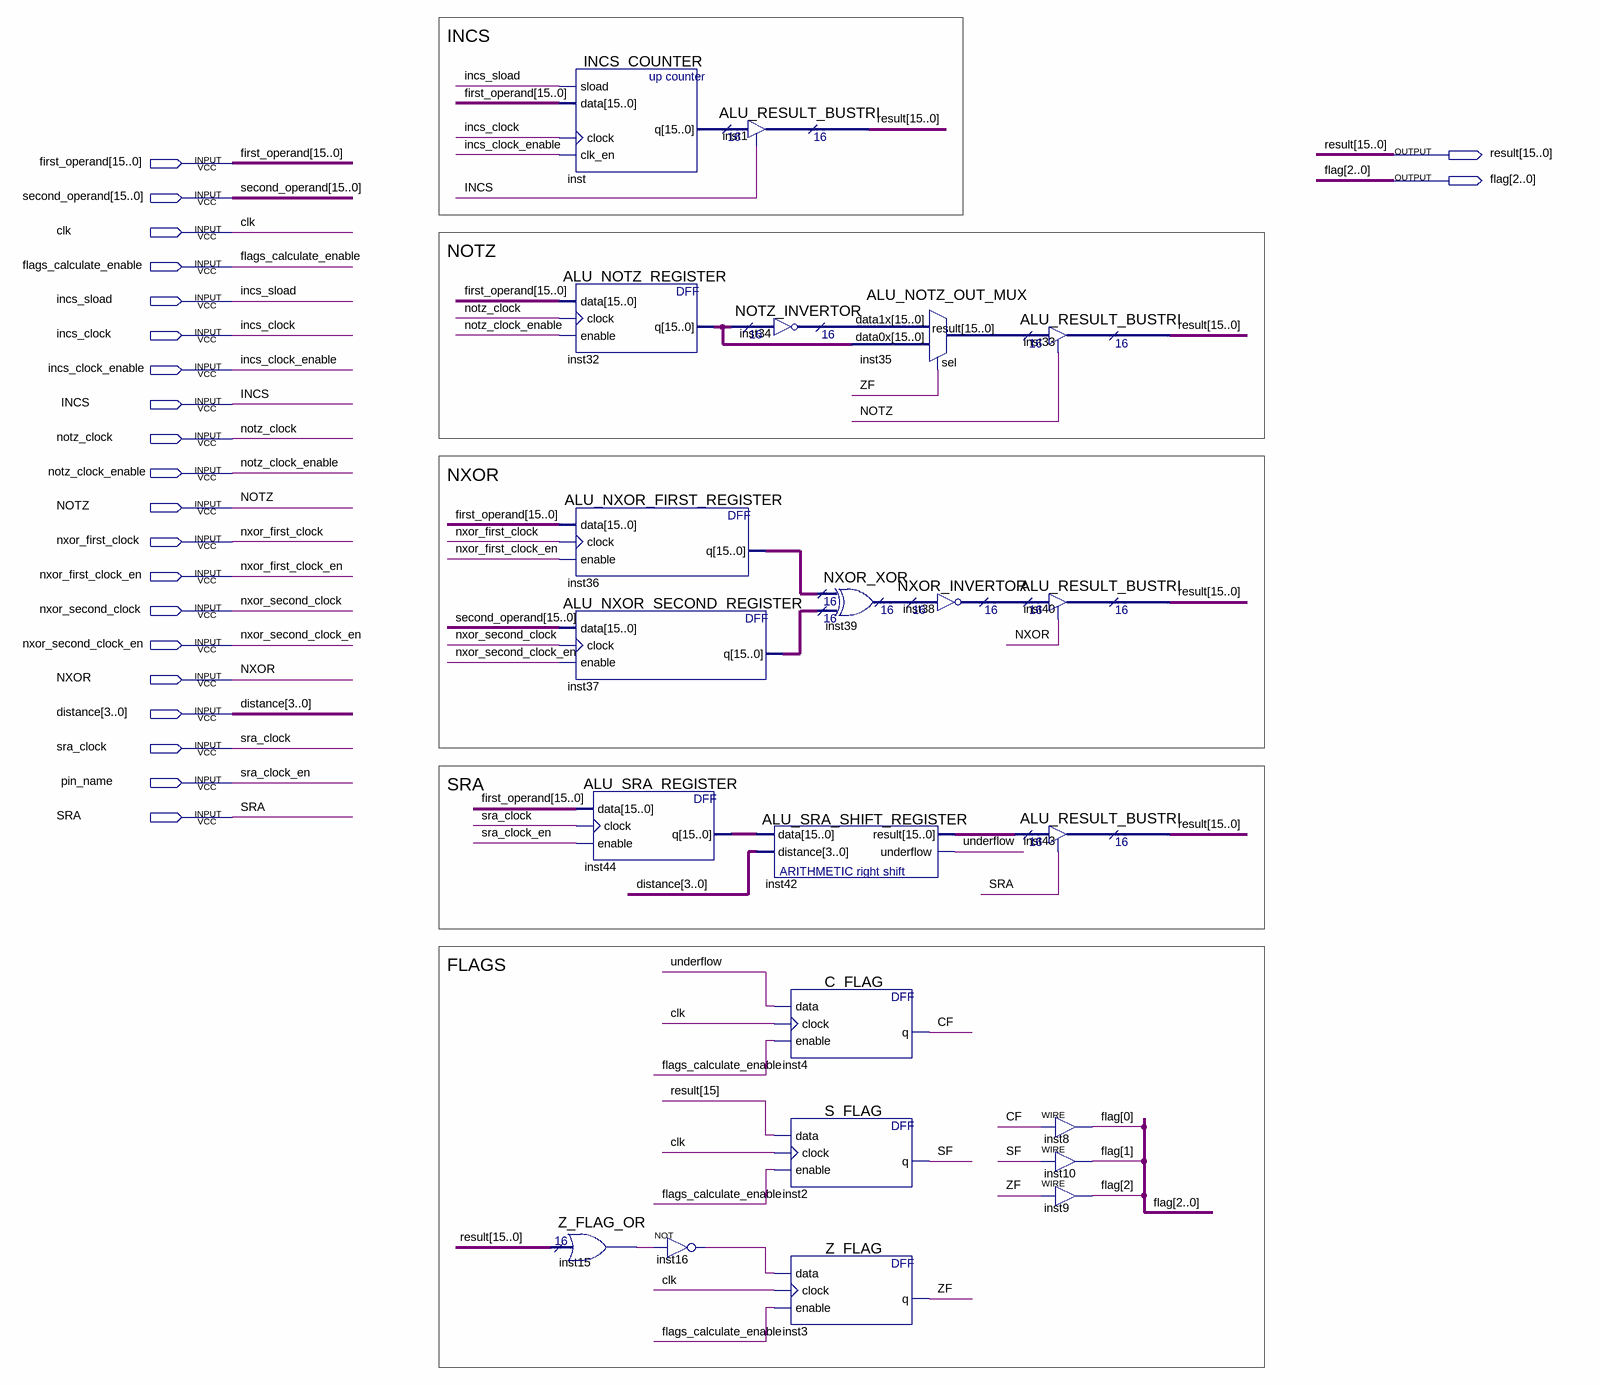
[diagram p0: schematic sheet]
// Quartus schematic ALU.bdf as structural Verilog: 22 symbols, 22 pins
module ALU (
  input  [15:0] first_operand,
  input  [15:0] second_operand,
  input  clk,
  input  flags_calculate_enable,
  input  incs_sload,
  input  incs_clock,
  input  incs_clock_enable,
  input  INCS,
  input  notz_clock,
  input  notz_clock_enable,
  input  NOTZ,
  input  nxor_first_clock,
  input  nxor_first_clock_en,
  input  nxor_second_clock,
  input  nxor_second_clock_en,
  input  NXOR,
  input  [3:0] distance,
  input  sra_clock,
  input  pin_name,
  input  SRA,
  output [15:0] result,
  output [2:0] flag
);

  wire CF, inst15_result, inst16_out, SF, underflow, ZF;
  wire [15:0] inst32_q, inst34_result, inst35_result, inst36_q, inst37_q, inst38_result, inst39_result,
       inst42_result, inst44_q, inst_q;

  Z_FLAG_OR inst15 (.data(result), .result(inst15_result));
  INCS_COUNTER inst (
    .sload(incs_sload), .data(first_operand), .clock(incs_clock), .clk_en(incs_clock_enable), .q(inst_q));
  ALU_NOTZ_REGISTER inst32 (.data(first_operand), .clock(notz_clock), .enable(notz_clock_enable), .q(inst32_q));
  ALU_NXOR_FIRST_REGISTER inst36 (
    .data(first_operand), .clock(nxor_first_clock), .enable(nxor_first_clock_en), .q(inst36_q));
  ALU_NXOR_SECOND_REGISTER inst37 (
    .data(second_operand), .clock(nxor_second_clock), .enable(nxor_second_clock_en), .q(inst37_q));
  ALU_SRA_REGISTER inst44 (.data(first_operand), .clock(sra_clock), .enable(pin_name), .q(inst44_q));
  not inst16 (inst16_out, inst15_result);
  ALU_RESULT_BUSTRI inst1 (.enabledt(INCS), .data(inst_q), .tridata(result));
  NOTZ_INVERTOR inst34 (.data(inst32_q), .result(inst34_result));
  ALU_SRA_SHIFT_REGISTER inst42 (.data(inst44_q), .distance(distance), .result(inst42_result), .underflow(underflow));
  NXOR_XOR inst39 (.data0x(inst36_q), .data1x(inst37_q), .result(inst39_result));
  C_FLAG inst4 (.data(underflow), .clock(clk), .enable(flags_calculate_enable), .q(CF));
  S_FLAG inst2 (.data(result[15]), .clock(clk), .enable(flags_calculate_enable), .q(SF));
  Z_FLAG inst3 (.data(inst16_out), .clock(clk), .enable(flags_calculate_enable), .q(ZF));
  ALU_NOTZ_OUT_MUX inst35 (.data1x(inst34_result), .data0x(inst32_q), .sel(ZF), .result(inst35_result));
  NXOR_INVERTOR inst38 (.data(inst39_result), .result(inst38_result));
  ALU_RESULT_BUSTRI inst33 (.enabledt(NOTZ), .data(inst35_result), .tridata(result));
  ALU_RESULT_BUSTRI inst40 (.enabledt(NXOR), .data(inst38_result), .tridata(result));
  ALU_RESULT_BUSTRI inst43 (.enabledt(SRA), .data(inst42_result), .tridata(result));
  assign flag[0] = CF;  // WIRE inst8
  assign flag[1] = SF;  // WIRE inst10
  assign flag[2] = ZF;  // WIRE inst9

  // Other names for the same wires on the sheet: sra_clock_en = pin_name

  // Notes on the sheet:
  //   INCS
  //   NOTZ
  //   NXOR
  //   SRA
  //   FLAGS
endmodule
